# Altium project Bemine-mc60.PrjPcb
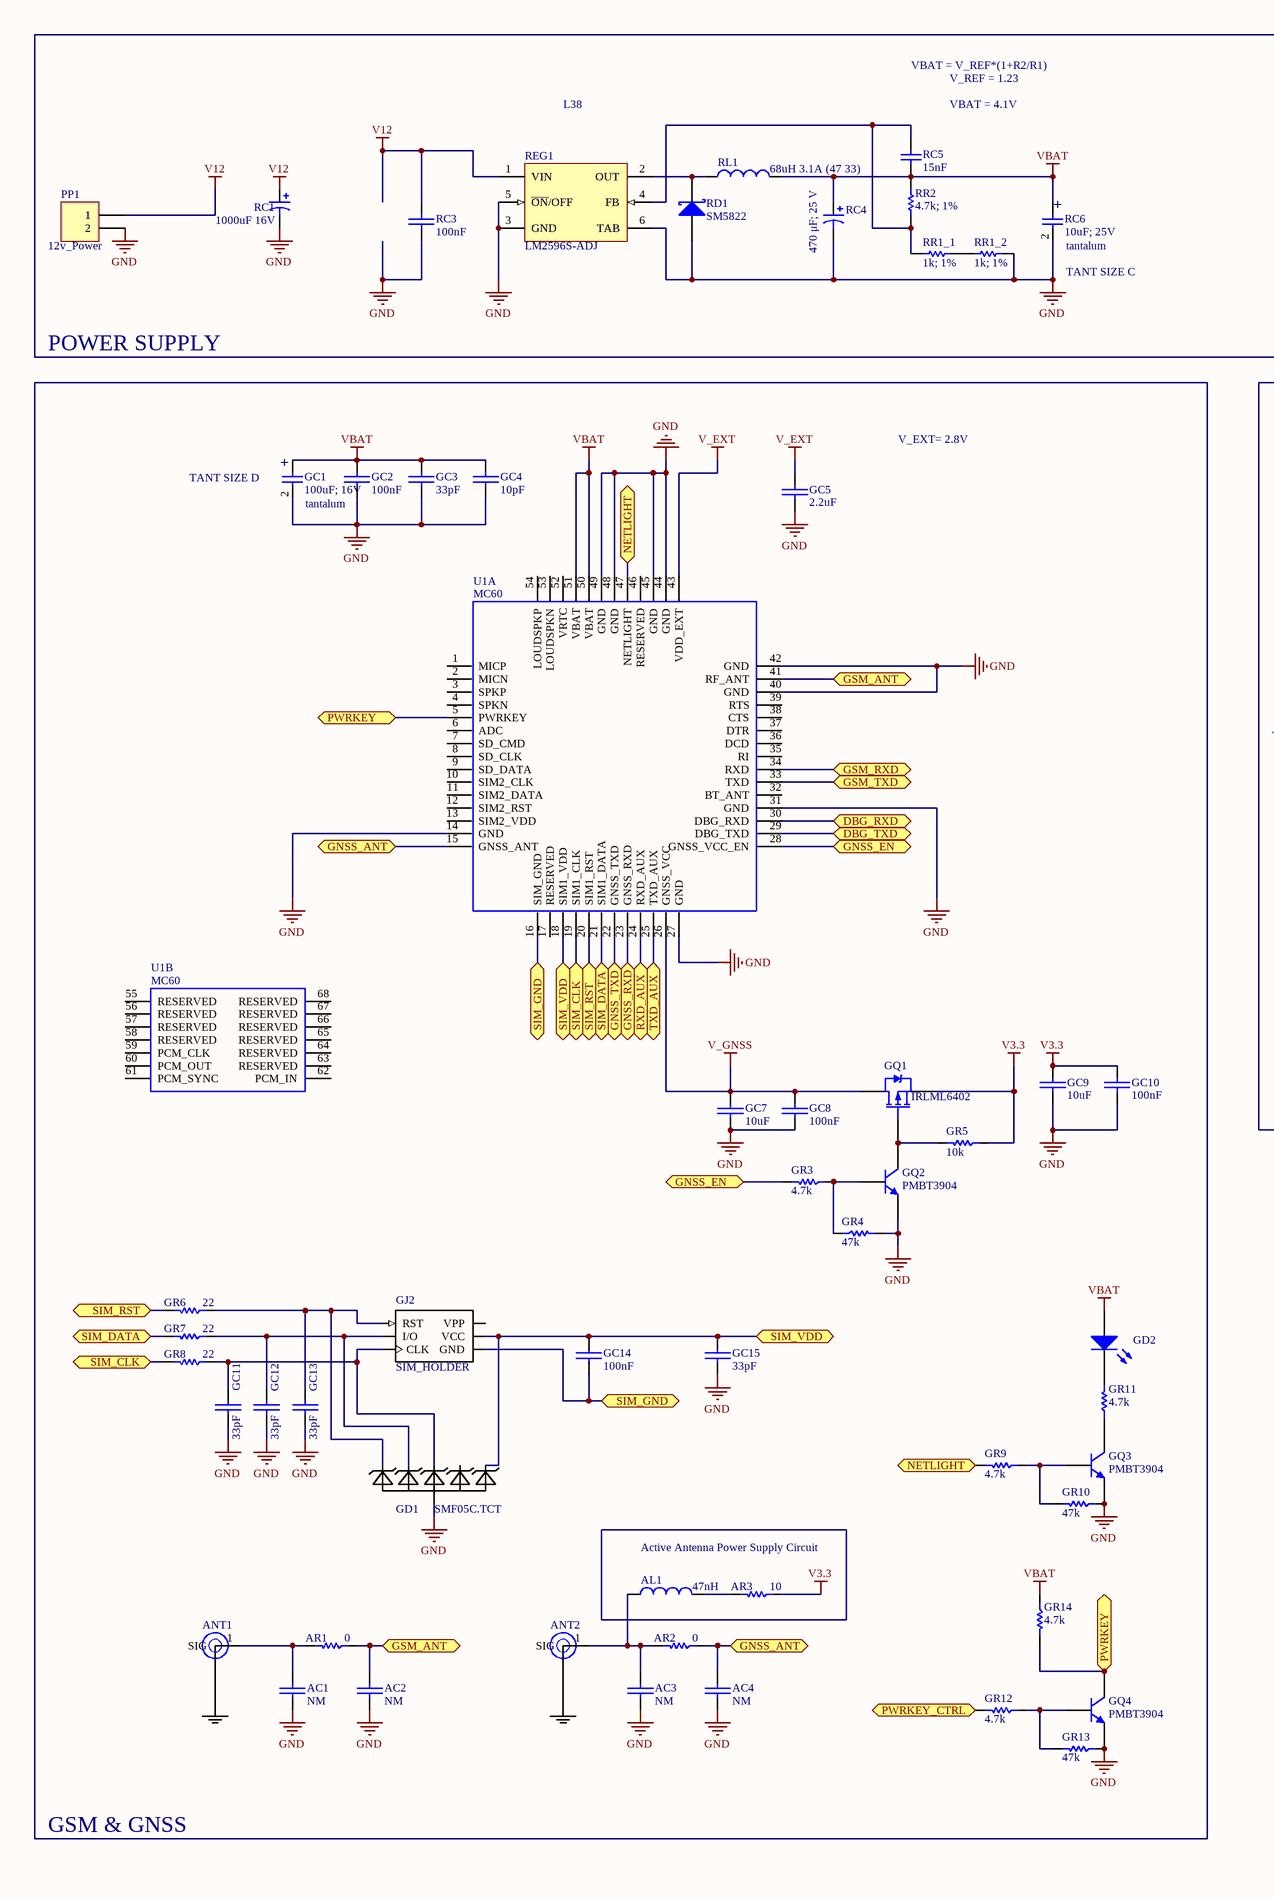
[diagram p0: Bemine-mc60_SCH.SchDoc, left]
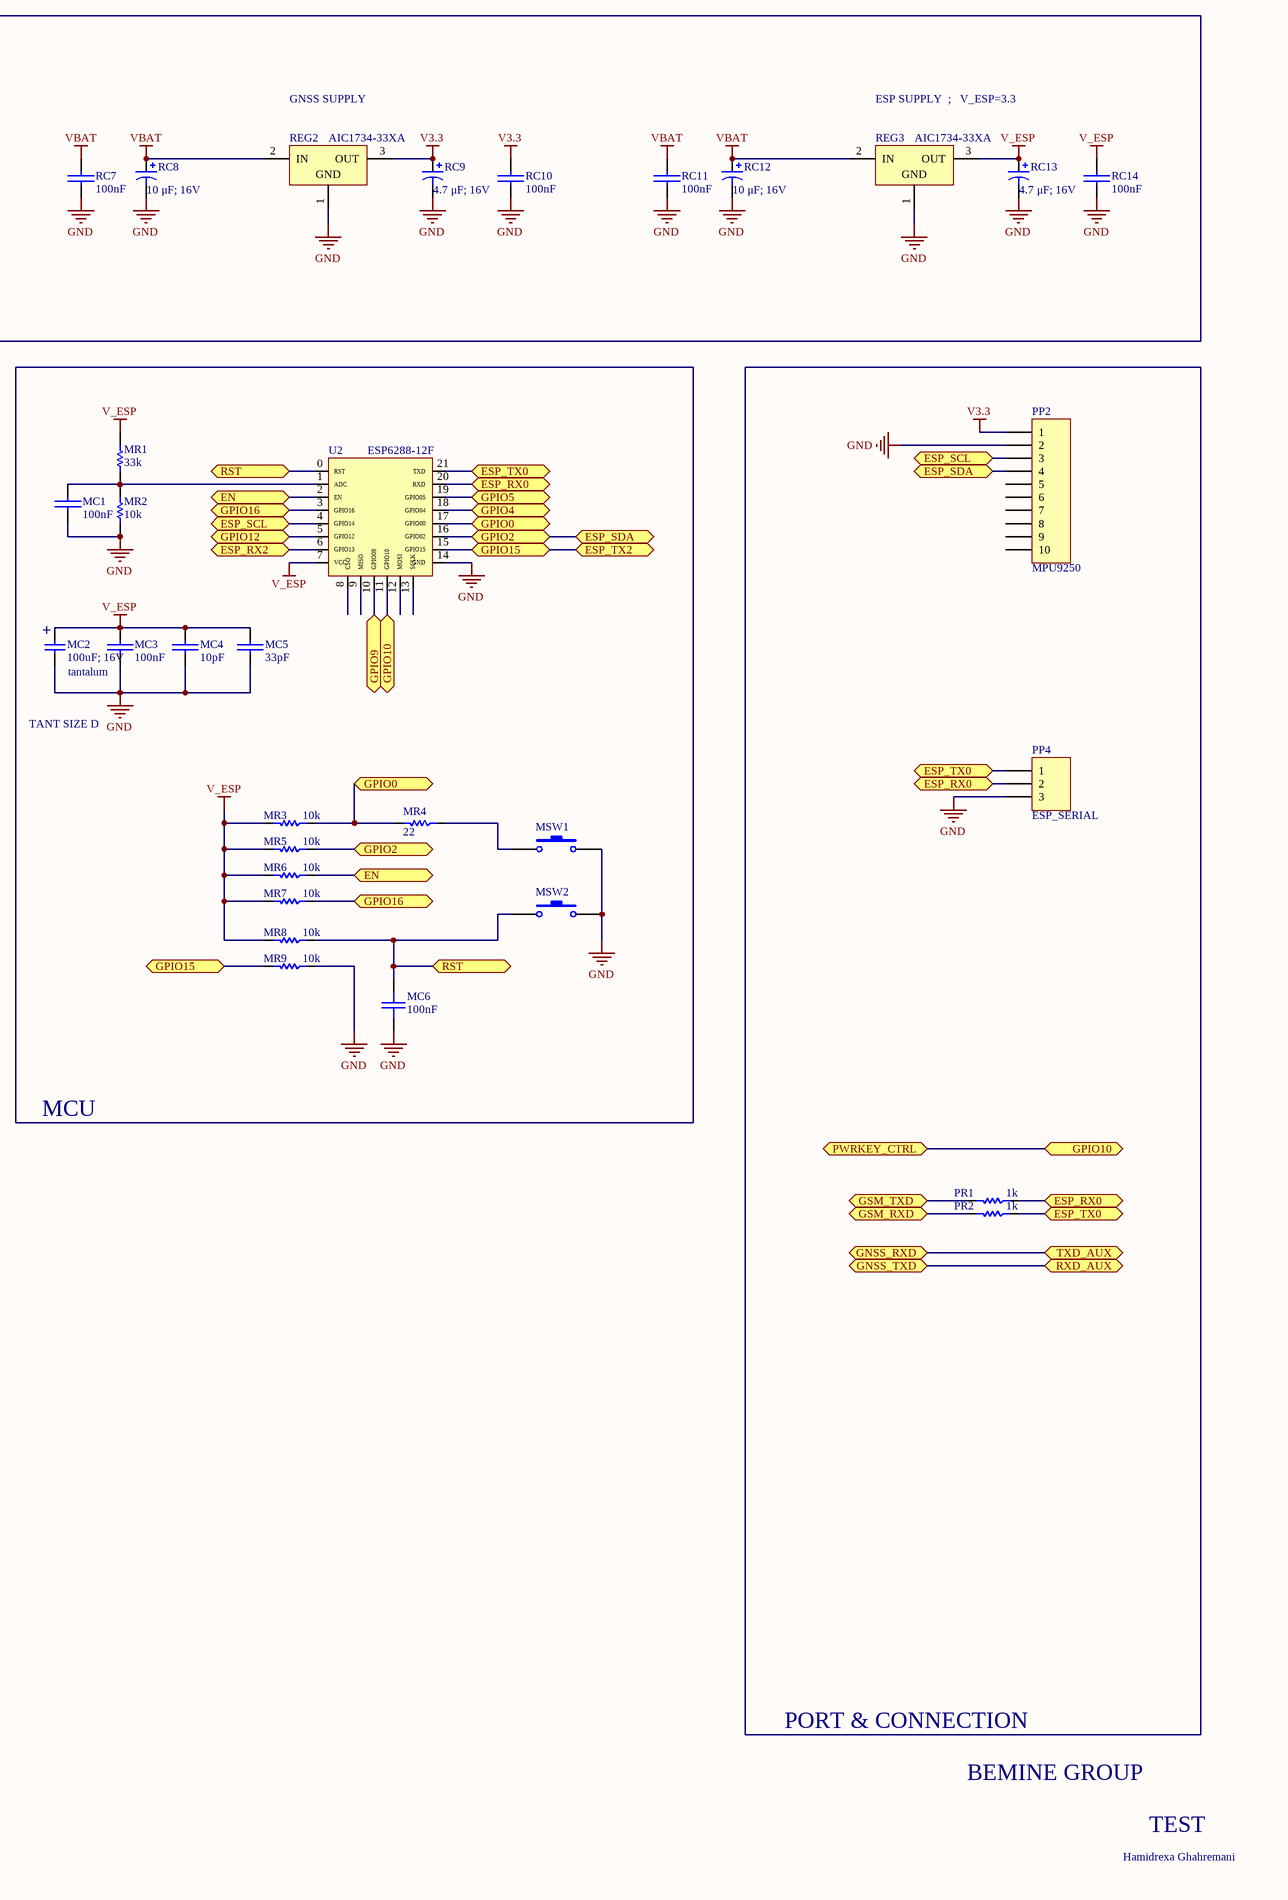
[diagram p1: Bemine-mc60_SCH.SchDoc, right]
1 sheet, 88 parts. Net scope: flat (ports and power ports of the same name join across sheets).
Board file: Bemine-mc60_PCB.PcbDoc

## Sheet Bemine-mc60_SCH.SchDoc
size C

### Parts
AC1  NM  [C1206]
AC2  NM  [C1206]
AC3  NM  [C1206]
AC4  NM  [C1206]
AL1  47nH  [Model Name]
ANT1  (no value)  [MOLEX_73412-0110]
ANT2  73412-0110  [MOLEX_73412-0110]  (value not drawn)
AR1  0  [C1206]
AR2  0  [C1206]
AR3  10  [Model Name]
GC1  100uF; 16V  TYPE: tantalum  [CAPCP7343X430N]
GC2  100nF  [C1206]
GC3  33pF  [C1206]
GC4  10pF  [C1206]
GC5  2.2uF  [C1206]
GC7  10uF  [C1206]
GC8  100nF  [C1206]
GC9  10uF  [C1206]
GC10  100nF  [C1206]
GC11  33pF  [C1206]
GC12  33pF  [C1206]
GC13  33pF  [C1206]
GC14  100nF  [C1206]
GC15  33pF  [C1206]
GD1  SMF05C.TCT  [SC70-6]
GD2  LED2  [C1206]  (value not drawn)
GJ2  SIM_HOLDER  [SIMCARD_SIZE_C]
GQ1  IRLML6402  [Micro3_N]
GQ2  PMBT3904  [SOT23_N]
GQ3  PMBT3904  [SOT23_N]
GQ4  PMBT3904  [SOT23_N]
GR3  4.7k  [C1206]
GR4  47k  [C1206]
GR5  10k  [C1206]
GR6  22  [C1206]
GR7  22  [C1206]
GR8  22  [C1206]
GR9  4.7k  [C1206]
GR10  47k  [C1206]
GR11  4.7k  [C1206]
GR12  4.7k  [C1206]
GR13  47k  [C1206]
GR14  4.7k  [C1206]
MC1  100nF  [C1206]
MC2  100uF; 16V  TYPE: tantalum  [CAPCP7343X430N]
MC3  100nF  [C1206]
MC4  10pF  [C1206]
MC5  33pF  [C1206]
MC6  100nF  [C1206]
MR1  33k  [C1206]
MR2  10k  [C1206]
MR3  10k  [C1206]
MR4  22  [C1206]
MR5  10k  [C1206]
MR6  10k  [C1206]
MR7  10k  [C1206]
MR8  10k  [C1206]
MR9  10k  [C1206]
MSW1  Switch PB  [TE FSMSMTR]  (value not drawn)
MSW2  Switch PB  [TE FSMSMTR]  (value not drawn)
PP1  12v_Power  [phoenix terminal R 2]
PP2  MPU9250  [HDR1X10]
PP4  ESP_SERIAL  [HDR1X3]
PR1  1k  [C1206]
PR2  1k  [C1206]
RC1  1000uF 16V  [CAPR5-4X5]
RC3  100nF  [C1206]
RC4  470 μF; 25 V  [WCAP-PSLC 10x12.4x4.5]
RC5  15nF  [C1206]
RC6  10uF; 25V  TYPE: tantalum  [CAPCP6032X280N]
RC7  100nF  [C1206]
RC8  10 μF; 16V  [WCAP-PSLP 5x5.8x1.4]
RC9  4.7 μF; 16V  [WCAP-PSLP 5x5.8x1.4]
RC10  100nF  [C1206]
RC11  100nF  [C1206]
RC12  10 μF; 16V  [WCAP-PSLP 5x5.8x1.4]
RC13  4.7 μF; 16V  [WCAP-PSLP 5x5.8x1.4]
RC14  100nF  [C1206]
RD1  SM5822  [SMB]
REG1  LM2596S-ADJ  [TS5B_N]
REG2  AIC1734-33XA  [SOT89N]
REG3  AIC1734-33XA  [SOT89N]
RL1  68uH 3.1A (47 33)  [CAPR5-4X5]
RR1_1  1k; 1%  [C1206]
RR1_2  1k; 1%  [C1206]
RR2  4.7k; 1%  [C1206]
U1  MC60  [XCVR_MC60]  (parts A,B of 2)
U2  ESP6288-12F  [ESP8266-12F]

### Blocks framed on the sheet
POWER SUPPLY: PP1 RC1 RC3-RC14 RD1 REG1-REG3 RL1 RR1_1 RR1_2 RR2
GSM & GNSS: AC1-AC4 ANT1 ANT2 AR1 AR2 GC1-GC5 GC7-GC15 GD1 GD2 GJ2 GQ1-GQ4 GR3-GR14 U1
MCU: MC1-MC6 MR1-MR9 MSW1 MSW2 U2
PORT & CONNECTION: PP2 PP4 PR1 PR2
Active Antenna Power Supply Circuit: AL1 AR3

### Ports
DBG_RXD (bidir), DBG_TXD (bidir), EN (bidir), ESP_RX0 (bidir), ESP_RX2 (bidir), ESP_SCL (bidir), ESP_SDA (bidir), ESP_TX0 (bidir), ESP_TX2 (bidir), GNSS_ANT (bidir), GNSS_EN (bidir), GNSS_RXD (bidir), GNSS_TXD (bidir), GPIO0 (bidir), GPIO2 (bidir), GPIO4 (bidir), GPIO5 (bidir), GPIO9 (bidir), GPIO10 (bidir), GPIO12 (bidir), GPIO15 (bidir), GPIO16 (bidir), GSM_ANT (bidir), GSM_RXD (bidir), GSM_TXD (bidir), NETLIGHT (bidir), PWRKEY (bidir), PWRKEY_CTRL (bidir), RST (bidir), RXD_AUX (bidir), SIM_CLK (bidir), SIM_DATA (bidir), SIM_GND, SIM_RST (bidir), SIM_VDD, TXD_AUX (bidir)

### Nets
GND: AC1.2(-) AC2.2(-) AC3.2(-) AC4.2(-) ANT1.2(GND) ANT1.3(GND) ANT1.4(GND) ANT2.2(GND) ANT2.3(GND) ANT2.4(GND) GC1.2 GC2.2(-) GC3.2(-) GC4.2(-) GC5.2(-) GC7.2(-) GC8.2(-) GC9.2(-) GC10.2(-) GC11.1(+) GC12.1(+) GC13.1(+) GC15.2(-) GD1.2(A) GQ2.2(E) GQ3.2(E) GQ4.2(E) GR4.2 GR10.1 GR13.1 MC1.2(-) MC2.2 MC3.2(-) MC4.2(-) MC5.2(-) MC6.2 MR2.1 MR9.1 MSW1.2 MSW2.2 PP1.2 PP2.2 PP4.3 RC1.2 RC3.2(-) RC4.2 RC6.2 RC7.2(-) RC8.2 RC9.2 RC10.2(-) RC11.2(-) RC12.2 RC13.2 RC14.2(-) RD1.1(A) REG1.3(GND) REG1.5(~{ON}/OFF) REG1.6(TAB) REG2.1(GND) REG3.1(GND) RR1_2.1 U1.14(GND) U1.27(GND) U1.31(GND) U1.40(GND) U1.42(GND) U1.44(GND) U1.45(GND) U1.48(GND) U1.49(GND) U2.14(GND)
V3.3: AR3.1 GC9.1(+) GC10.1(+) GQ1.2(S) GR5.1 PP2.1 RC9.1 RC10.1(+) REG2.3(OUT)
V12: PP1.1 RC1.1 RC3.1(+) REG1.1(VIN)
V_ESP: MC2.1 MC3.1(+) MC4.1(+) MC5.1(+) MR1.2 MR3.2 MR5.2 MR6.2 MR7.2 MR8.2 RC13.1 RC14.1(+) REG3.3(OUT) U2.7(VCC)
V_EXT: GC5.1(+) U1.43(VDD_EXT)
V_GNSS: GC7.1(+) GC8.1(+) GQ1.3(D) U1.26(GNSS_VCC)
VBAT: GC1.1 GC2.1(+) GC3.1(+) GC4.1(+) GD2.1(A) GR14.1 RC4.1 RC5.1 RC6.1 RC7.1(+) RC8.1 RC11.1(+) RC12.1 REG2.2(IN) REG3.2(IN) RL1.2 RR2.1 U1.50(VBAT) U1.51(VBAT)
NetAC1_1: AC1.1(+) ANT1.1(SIG) AR1.2
NetAC2_1: AC2.1(+) AR1.1 U1.41(RF_ANT) ; port GSM_ANT
NetAC3_1: AC3.1(+) AL1.1 ANT2.1(SIG) AR2.2
NetAC4_1: AC4.1(+) AR2.1 U1.15(GNSS_ANT) ; port GNSS_ANT
NetAL1_2: AL1.2 AR3.2
NetGC11_2: GC11.2(-) GD1.4(C3) GJ2.C3(CLK) GR8.1
NetGC12_2: GC12.2(-) GD1.3(C2) GJ2.C7(I/O) GR7.1
NetGC13_2: GC13.2(-) GD1.1(C1) GJ2.C2(RST) GR6.1
NetGC14_1: GC14.1(+) GC15.1(+) GD1.6(C5) GJ2.C1(VCC) U1.18(SIM1_VDD) ; port SIM_VDD
NetGC14_2: GC14.2(-) GJ2.C5(GND) U1.16(SIM_GND) ; port SIM_GND
NetGD2_2: GD2.2(K) GR11.2
NetGQ1_1: GQ1.1(G) GQ2.3(C) GR5.2
NetGQ2_1: GQ2.1(B) GR3.1 GR4.1
NetGQ3_1: GQ3.1(B) GR9.1 GR10.2
NetGQ3_3: GQ3.3(C) GR11.1
NetGQ4_1: GQ4.1(B) GR12.1 GR13.2
NetGQ4_3: GQ4.3(C) GR14.2 U1.5(PWRKEY) ; port PWRKEY
NetGR3_2: GR3.2 U1.28(GNSS_VCC_EN) ; port GNSS_EN
NetGR6_2: GR6.2 U1.20(SIM1_RST) ; port SIM_RST
NetGR7_2: GR7.2 U1.21(SIM1_DATA) ; port SIM_DATA
NetGR8_2: GR8.2 U1.19(SIM1_CLK) ; port SIM_CLK
NetGR9_2: GR9.2 U1.47(NETLIGHT) ; port NETLIGHT
NetGR12_2: GR12.2 U2.11(GPIO10) ; port GPIO10, port PWRKEY_CTRL
NetMC1_1: MC1.1(+) MR1.1 MR2.2 U2.1(ADC)
NetMC6_1: MC6.1 MR8.1 MSW2.1 U2.0(RST) ; port RST
NetMR3_1: MR3.1 MR4.2 U2.17(GPIO00) ; port GPIO0
NetMR4_1: MR4.1 MSW1.1
NetMR5_1: MR5.1 PP2.4 U2.16(GPIO02) ; port GPIO2, port ESP_SDA
NetMR6_1: MR6.1 U2.2(EN) ; port EN
NetMR7_1: MR7.1 U2.3(GPIO16) ; port GPIO16
NetMR9_2: MR9.2 U2.15(GPIO15) ; port GPIO15, port ESP_TX2
NetPP2_3: PP2.3 U2.4(GPIO14) ; port ESP_SCL
NetPP4_1: PP4.1 PR2.1 U2.21(TXD) ; port ESP_TX0
NetPP4_2: PP4.2 PR1.1 U2.20(RXD) ; port ESP_RX0
NetPR1_2: PR1.2 U1.33(TXD) ; port GSM_TXD
NetPR2_2: PR2.2 U1.34(RXD) ; port GSM_RXD
NetRC5_2: RC5.2 REG1.4(FB) RR1_1.2 RR2.2
NetRD1_2: RD1.2(K) REG1.2(OUT) RL1.1
NetRR1_1_1: RR1_1.1 RR1_2.2
NetU1_22: U1.22(GNSS_TXD) U1.24(RXD_AUX) ; port RXD_AUX, port GNSS_TXD
NetU1_23: U1.23(GNSS_RXD) U1.25(TXD_AUX) ; port TXD_AUX, port GNSS_RXD
NetU1_29: U1.29(DBG_TXD) ; port DBG_TXD
NetU1_30: U1.30(DBG_RXD) ; port DBG_RXD
NetU2_5: U2.5(GPIO12) ; port GPIO12
NetU2_6: U2.6(GPIO13) ; port ESP_RX2
NetU2_10: U2.10(GPIO09) ; port GPIO9
NetU2_18: U2.18(GPIO04) ; port GPIO4
NetU2_19: U2.19(GPIO05) ; port GPIO5

Not connected (* = marked no-connect by the designer): GD1 5(C4); GJ2 C6(VPP); PP2 5 6 7 8 9 10; U1 1(MICP) 2(MICN) 3(SPKP) 4(SPKN) 6(ADC) 7(SD_CMD) 8(SD_CLK) 9(SD_DATA) 10(SIM2_CLK) 11(SIM2_DATA) 12(SIM2_RST) 13(SIM2_VDD) 17(RESERVED) 32(BT_ANT) 35(RI) 36(DCD) 37(DTR) 38(CTS) 39(RTS) 46(RESERVED) 52(VRTC) 53(LOUDSPKN) 54(LOUDSPKP) 55(RESERVED) 56(RESERVED) 57(RESERVED) 58(RESERVED) 59(PCM_CLK) 60(PCM_OUT) 61(PCM_SYNC) 62(PCM_IN) 63(RESERVED) 64(RESERVED) 65(RESERVED) 66(RESERVED) 67(RESERVED) 68(RESERVED); U2 8(CSO) 9(MISO) 12(MOSI) 13(SCLK)

### Notes on the sheet
- L38
- VBAT = V_REF*(1+R2/R1)
- VBAT = 4.1V
- V_REF = 1.23
- GNSS SUPPLY
- ESP SUPPLY  ;   V_ESP=3.3
- (near RC6) +
- (near RC6) TANT SIZE C
- V_EXT= 2.8V
- (near GC1) TANT SIZE D
- (near GC1) +
- (near MC2) +
- TANT SIZE D
- BEMINE GROUP
- Hamidrexa Ghahremani
- TEST

### Library data of the parts
AC1-AC4 GC2-GC5 GC7-GC15 MC1 MC3-MC5 RC3 RC7 RC10 RC11 RC14 = Cap-Bipolar: Bipolar Capacitor; Voltage: 100V; Designer: Saeid Jorablo; Organazation: ControTec; Adding Date: 1387/12/20
  AC1-AC4: Value: NM
  GC2 GC8 GC10 GC14 MC1 MC3 RC3 RC7 RC10 RC11 RC14: Value: 100nF
  GC3 GC11-GC13 GC15 MC5: Value: 33pF
  GC4 MC4: Value: 10pF
  GC5: Value: 2.2uF
  GC7 GC9: Value: 10uF
AL1 RL1 = Inductor: Code_IEC: 1005; Value: 10mH; Published: 8-Jun-2000; LatestRevisionDate: 29-May-2009; LatestRevisionNote: IPC-7351 Footprint Added.; PackageReference: 0402-A; Publisher: Altium Limited; PackageDescription: Chip Inductor; Code_JEITA: 0402
ANT1 ANT2 = 73412-0110: 50 Ohms, Microcoaxial RF, PCB Vertical Jack Receptacle, SMT, 1.25mm Mounted Height; MF: Molex; MP: 73412-0110; Package: None; Price: 0.40 USD; Availability: Good; Value: *
AR1-AR3 GR3-GR14 MR3-MR9 PR1 PR2 = Resistor
  AR1 AR2: Value: 0
  AR3: Value: 10
  GR3 GR9 GR11 GR12 GR14: Value: 4.7k
  GR4 GR10 GR13: Value: 47k
  GR5 MR3 MR5-MR9: Value: 10k
  GR6-GR8 MR4: Value: 22
  PR1 PR2: Value: 1k
GC1 MC2 RC5 RC6 = Cap: Capacitor; STATE: NOT-AVAILABLE; Published: 8-Jun-2000; LatestRevisionDate: 17-Jul-2002; LatestRevisionNote: Re-released for DXP Platform.; PackageReference: RAD-0.3; Publisher: Altium Limited; PackageDescription: Radial Cap, Thru-Hole; 2 Leads; 0.3 in Pin Spacing
  RC5: TYPE: tantalum
GD1 = SMF05C.TCT: MF: Semtech; Price: None; Package: SOT-363 Diodes Inc.; Availability: Unavailable; MP: SMF05C.TCT; Value: *
GD2 = LED2: Typical RED, GREEN, YELLOW, AMBER GaAs LED; Published: 8-Jun-2000; LatestRevisionDate: 17-Jul-2002; LatestRevisionNote: Re-released for DXP Platform.; PackageVersion: Feb-2002; PackageReference: 3.2X1.6X1.1; Publisher: Altium Limited; PackageDescription: SM LED; 2 Flat Leads
GJ2 = SIM5051-6-0-18-00-X_REVF: Memory Socket, Sim Card, 6pos; MF: Global Connector Technology; MP: SIM5051-6-0-18-00-A REV C; Price: None; Package: None; Availability: Unavailable; Value: *
GQ1 = IRLML6401: HEXFET Power MOSFET; Published: 17-Sep-2003; DatasheetVersion: 2-Jul-2001; PackageVersion: Jul-2001; PackageReference: Micro3; Publisher: Altium Limited; PackageDescription: 3-Pin SOT-23 Package 0.95 mm Pitch, 2.3 mm Lead Span; ComponentLink1Description: Manufacturer Link; ComponentLink1URL: http://www.irf.com/; ComponentLink2Description: Datasheet; ComponentLink2URL: http://www.irf.com/product-info/datasheets/data/IRLML6401.pdf
GQ2-GQ4 = PMBT3904: NPN Switching Transistor; Published: 17-Sep-2003; LatestRevisionDate: 12-Dec-2006; LatestRevisionNote: IPC-7351 Footprint Added.; DatasheetVersion: 27-Apr-1999; PackageVersion: May-1999; PackageReference: SOT23; Publisher: Altium Limited; PackageDescription: 3-Pin SOT-23 Package 0.95 mm Pitch, 2.3 mm Lead Span; ComponentLink1Description: Manufacturer Link; ComponentLink1URL: http://www.semiconductors.philips.com/; ComponentLink2Description: Datasheet; ComponentLink2URL: http://www.semiconductors.philips.com/acrobat/datasheets/PMBT3904_4.pdf
MC6 = SMT_C_0402: Surface mount capacitor 0402
MR1 MR2 RR1_1 RR1_2 RR2 = Res1: Resistor; Published: 8-Jun-2000; LatestRevisionDate: 17-Jul-2002; LatestRevisionNote: Re-released for DXP Platform.; PackageReference: AXIAL-0.3; Publisher: Altium Limited; PackageDescription: Axial Device, Thru-Hole; 2 Leads; 0.3 in Pin Spacing
  MR1: Value: 33k
  MR2: Value: 10k
  RR1_1 RR1_2: Value: 1k; 1%
  RR2: Value: 4.7k; 1%
MSW1 MSW2 = Switch PB: Push Button Switch
PP1 = Header 2: Header, 2-Pin; LatestRevisionDate: 17-Jul-2002; LatestRevisionNote: Re-released for DXP Platform.; Publisher: Altium Limited
PP2 = Header 10: Header, 10-Pin; LatestRevisionDate: 17-Jul-2002; LatestRevisionNote: Re-released for DXP Platform.; Publisher: Altium Limited
PP4 = Header 3: Header, 3-Pin; LatestRevisionDate: 17-Jul-2002; LatestRevisionNote: Re-released for DXP Platform.; Publisher: Altium Limited
RC1 = Cap Pol1: Polarized Capacitor (Radial); Value: 100pF; Published: 8-Jun-2000; LatestRevisionDate: 17-Jul-2002; LatestRevisionNote: Re-released for DXP Platform.; PackageReference: RB7.6-15; Publisher: Altium Limited; PackageDescription: Polarized Capacitor (Radial); 2 Leads
RC4 = WCAP-PSLC 10x12.4x4.5 875075361006: WCAP-PSLC Aluminum Polymer Capacitors , 680 μF; + / - 20%; 16 V , 10 x 12,4; Manufacturer: Wurth Elektronik; E-mail: libraries@we-online.com; Capacitance: 680 μF; Characteristics: Aluminum Polymer Capacitors; Recommended soldering: Reflow; Operating temperature: –55 °C to +105 °C; Large capacitance SMD product series; Very low ESR at high frequency range; High permissible ripple current; Long life and high reliability; Load life: 2000 h @ +105 °C; ComponentLink1Description: Manufacturer; ComponentLink1URL: http://www.we-online.com; ComponentLink2Description: Datasheet; ComponentLink2URL: http://katalog.we-online.de/pbs/datasheet/875075361006.pdf; Created by: Karrer Zheng; Created Date: 6/8/2015; Application: Low voltage port filtering, appplid to high-end switching power supply, PC(desktop,laptop ),industrial computer, VGA card, server power, charger, TV, digital set-top box,DC-DC power module, game machine etc which consume large current with high speed circuit.; partNo: 875075361006
RC8 RC12 = WCAP-PSLP 5x5.8x1.4 875105359001: WCAP-PSLP Aluminum Polymer Capacitors , 10 μF; + / - 20%; 16 V , 5 x 5,8; Manufacturer: Wurth Elektronik; E-mail: libraries@we-online.com; Capacitance: 10 μF; Characteristics: Aluminum Polymer Capacitors;Recommended soldering: Reflow;Operating temperature: –55 °C to +105 °C;Low profile SMD product series;Low ESR at high frequency range;High permissible ripple current;Load life: 2000 h @ +105 °C; ComponentLink1Description: Manufacturer; ComponentLink1URL: http://www.we-online.com; ComponentLink2Description: Datasheet; ComponentLink2URL: http://katalog.we-online.de/pbs/datasheet/875105359001.pdf; Created by: Karrer Zheng; Created Date: 5/13/2015; Application: Low voltage port filtering, appplid to high-end switching power supply, PC(desktop,laptop ),industrial computer, VGA card, server power, charger, TV, digital set-top box,DC-DC power module, game machine etc which consume large current with high speed circuit.; partNo: 875105359001
RC9 RC13 = WCAP-PSLP 5x5.8x1.4 875105359003: WCAP-PSLP Aluminum Polymer Capacitors , 22 μF; + / - 20%; 16 V , 5 x 5,8; Manufacturer: Wurth Elektronik; E-mail: libraries@we-online.com; Capacitance: 22 μF; Characteristics: Aluminum Polymer Capacitors;Recommended soldering: Reflow;Operating temperature: –55 °C to +105 °C;Low profile SMD product series;Low ESR at high frequency range;High permissible ripple current;Load life: 2000 h @ +105 °C; ComponentLink1Description: Manufacturer; ComponentLink1URL: http://www.we-online.com; ComponentLink2Description: Datasheet; ComponentLink2URL: http://katalog.we-online.de/pbs/datasheet/875105359003.pdf; Created by: Karrer Zheng; Created Date: 5/13/2015; Application: Low voltage port filtering, appplid to high-end switching power supply, PC(desktop,laptop ),industrial computer, VGA card, server power, charger, TV, digital set-top box,DC-DC power module, game machine etc which consume large current with high speed circuit.; partNo: 875105359003
RD1 = D Schottky: Schottky Diode; Published: 8-Jun-2000; LatestRevisionDate: 17-Jul-2002; LatestRevisionNote: Re-released for DXP Platform.; PackageReference: SMB; Publisher: Altium Limited; PackageDescription: DO-214-AA/SMB; 2 C-Bend Leads; Body 5.3 x 3.6 mm, inc. leads (LxW); Code_JEDEC: DO-214-AA
REG1 = LM2596S-ADJ: SIMPLE SWITCHER® Power Converter 150 KHz 3A Step-Down Voltage Regulator, 5-pin TO-263; Manufacturer: National Semiconductor; PackageTopMarking: NSUZXYTTE#*LM2596S*-ADJ P+; PowerWise: N; Published: 4-Dec-2008; DatasheetVersion: May-2002; PackageVersion: revD, Apr-2005; PackageReference: TS5B; Publisher: Altium Limited; PackageDescription: TO-263, Molded, .400 x .390 x .180in, 5 Lead, .067in Pitch, Surface Mount; Supplier 1: Farnell; Supplier Part Number 1: 1523864; Supplier 2: Farnell; Supplier Part Number 2: 9494367; PartNumber: LM2596S-ADJ; RoHS: N; PinCount: 5; CompType: Switcher; Code_JEDEC: MO-169-AB; ComponentLink1Description: LM2596 Datasheet; ComponentLink1URL: http://www.national.com/ds/LM/LM2596.pdf; ComponentLink2Description: LM2596 Web Page; ComponentLink2URL: http://www.national.com/pf/LM/LM2596.html; ComponentLink3Description: TS5B Package Page; ComponentLink3URL: http://www.national.com/packaging/folders/ts5b.html
REG2 REG3 = HT7530-1: 3.0V 100mA Low Power,  Low Dropout Voltage (LDO) Regulator; Published: 30-Mar-2007; DatasheetVersion: rev1.50, Jan-2006; PackageVersion: Jan-2006; PackageReference: SOT-89; Publisher: Altium Limited; PackageDescription: 3-Pin SOT-89 Package 1.5 mm Pitch, 4.1 mm Lead Span; Code_IPC: SOT89; ComponentLink1Description: Manufacturer Link; ComponentLink1URL: http://www.holtek.com/; ComponentLink2Description: Datasheet; ComponentLink2URL: http://www.holtek.com/pdf/consumer/75xx_1v150.pdf
U2 = ESP8266-12F: Value: ESP6288-12F
U1 = MC60: PCB DECAL: *